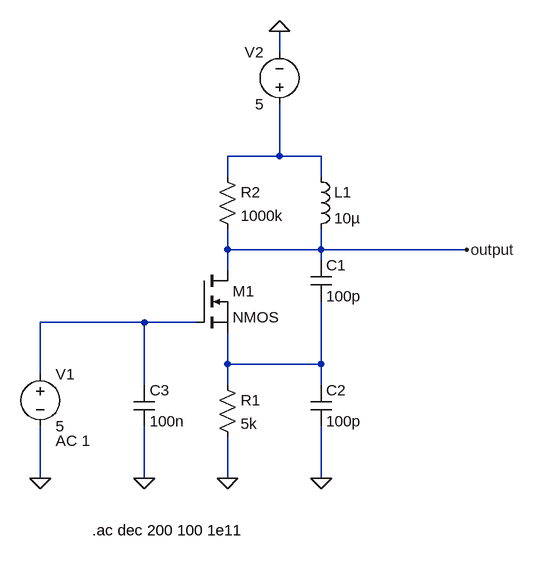
[diagram p0: schematic Colpitts.asc]
Colpitts.asc, the LTspice schematic file:
Version 4
SHEET 1 880 680
WIRE 224 -112 224 -144
WIRE 224 48 224 -32
WIRE 224 48 144 48
WIRE 288 48 224 48
WIRE 144 80 144 48
WIRE 288 80 288 48
WIRE 144 192 144 160
WIRE 288 192 288 160
WIRE 288 192 144 192
WIRE 512 192 288 192
WIRE 288 208 288 192
WIRE 144 224 144 192
WIRE 16 304 -144 304
WIRE 96 304 16 304
WIRE 144 368 144 320
WIRE 288 368 288 272
WIRE 288 368 144 368
WIRE -144 384 -144 304
WIRE 16 400 16 304
WIRE 144 400 144 368
WIRE 288 400 288 368
WIRE -144 544 -144 464
WIRE 16 544 16 464
WIRE 144 544 144 480
WIRE 288 544 288 464
FLAG 512 192 output
FLAG 224 -144 0
FLAG 144 544 0
FLAG 288 544 0
FLAG 16 544 0
FLAG -144 544 0
DATAFLAG 288 368 "$"
SYMBOL res 128 64 R0
SYMATTR InstName R2
SYMATTR Value 1000k
SYMBOL cap 272 208 R0
SYMATTR InstName C1
SYMATTR Value 100p
SYMBOL cap 272 400 R0
SYMATTR InstName C2
SYMATTR Value 100p
SYMBOL ind 272 64 R0
SYMATTR InstName L1
SYMATTR Value 10µ
SYMBOL Voltage 224 -16 R180
WINDOW 0 24 96 Left 2
WINDOW 3 24 16 Left 2
SYMATTR InstName V2
SYMATTR Value 5
SYMBOL cap 0 400 R0
SYMATTR InstName C3
SYMATTR Value 100n
SYMBOL Res 128 384 R0
SYMATTR InstName R1
SYMATTR Value 5k
SYMBOL Voltage -144 368 R0
WINDOW 123 24 118 Left 2
SYMATTR InstName V1
SYMATTR Value 5
SYMATTR Value2 AC 1
SYMBOL nmos 96 224 R0
SYMATTR InstName M1
TEXT -64 624 Left 2 !.ac dec 200 100 1e11

The netlist it stands for:
* Colpitts.asc
R2 N001 output 1000k
C1 output N003 100p
C2 N003 0 100p
L1 N001 output 10µ
V2 N001 0 5
C3 N002 0 100n
R1 N003 0 5k
V1 N002 0 5 AC 1
M1 output N002 N003 N003 NMOS
.model NMOS NMOS
.model PMOS PMOS
.lib standard.mos
.ac dec 200 100 1e11
.backanno
.end